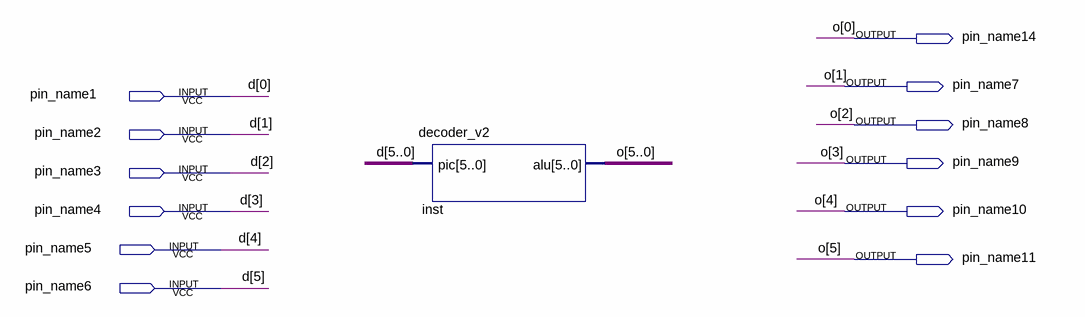
[diagram p0: schematic sheet]
// Quartus schematic decoder_v2.bdf as structural Verilog: 1 symbols, 12 pins
module decoder_v2 (
  input  pin_name1,
  input  pin_name2,
  input  pin_name3,
  input  pin_name4,
  input  pin_name5,
  input  pin_name6,
  output pin_name14,
  output pin_name7,
  output pin_name8,
  output pin_name9,
  output pin_name10,
  output pin_name11
);

  decoder_v2 inst (
    .pic({pin_name6, pin_name5, pin_name4, pin_name3, pin_name2, pin_name1}),
    .alu({pin_name11, pin_name10, pin_name9, pin_name8, pin_name7, pin_name14}));

  // Other names for the same wires on the sheet: d[5:0] = {pin_name6, pin_name5, pin_name4, pin_name3, pin_name2, pin_name1};
  //   o[5:0] = {pin_name11, pin_name10, pin_name9, pin_name8, pin_name7, pin_name14}
endmodule
